# EAGLE design Stemma_Notecard (EAGLE 9.6.2)
COMPANY: ADAFRUIT INDUSTRIES; DRAWN: KTOWN; REV: A
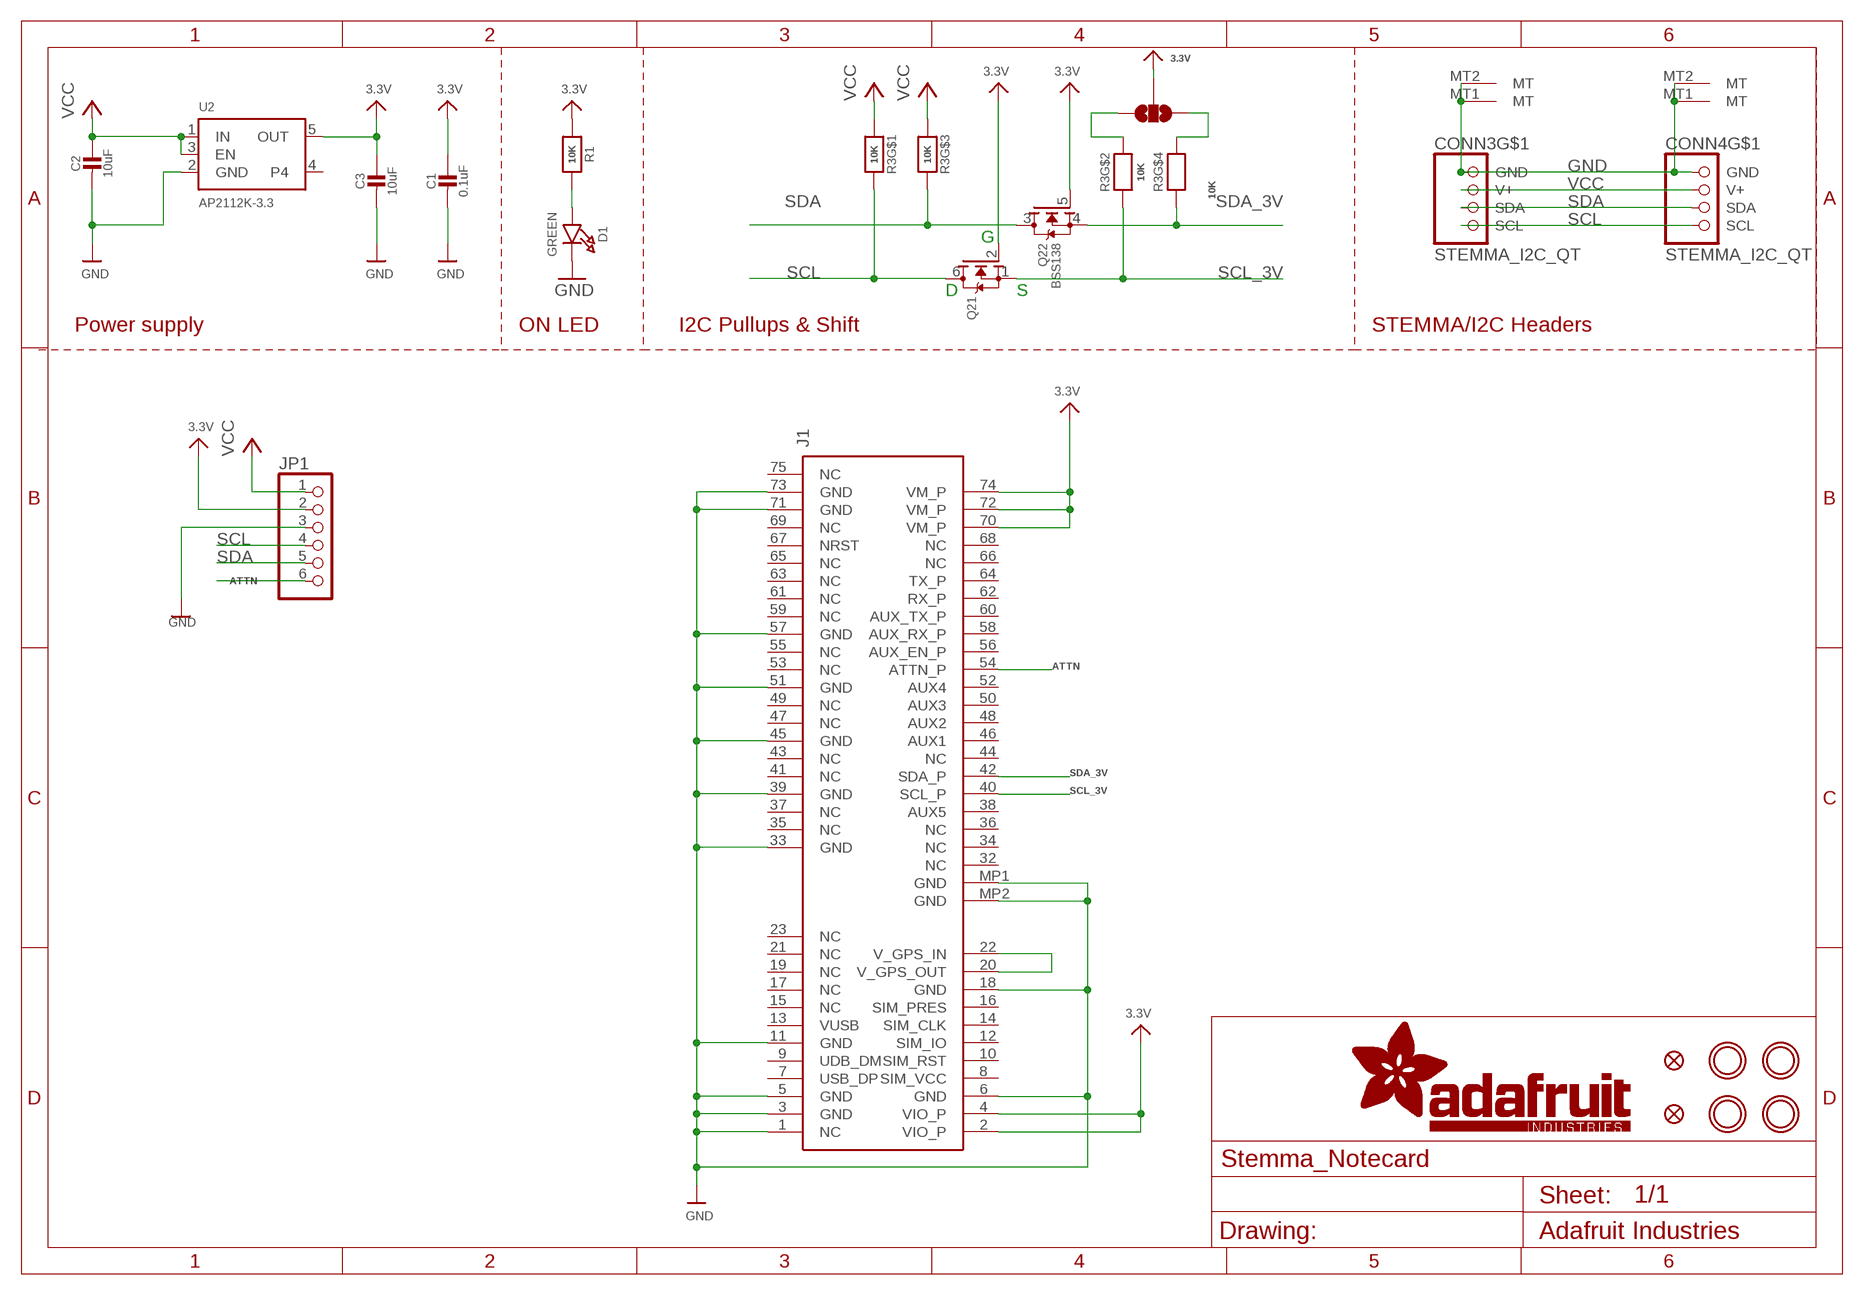
[diagram p0: schematic, sheet 1]

## Parts
C1  0.1uF  CAP_CERAMIC0603_NO  [0603-NO]
C2  10uF  CAP_CERAMIC0805-NOOUTLINE  [0805-NO]
C3  10uF  CAP_CERAMIC0805-NOOUTLINE  [0805-NO]
CONN3  STEMMA_I2C_QT  [JST_SH4]
CONN4  STEMMA_I2C_QT  [JST_SH4]
D1  GREEN  LED0603_NOOUTLINE  [CHIPLED_0603_NOOUTLINE]
FID3  FIDUCIAL_1MM  [FIDUCIAL_1MM]
FID4  FIDUCIAL_1MM  [FIDUCIAL_1MM]
J1  MDT420E01001NOTECARD  [NOTECARD]
JP1  HEADER-1X670MIL  [1X06_ROUND_70]
JP2  JUMPER-SMT_3_NO_NO-SILK  [SMT-JUMPER_3_NO_NO-SILK]
Q2  BSS138  MOSFET-N_DUAL  [SOT363]
R1  10K  RESISTOR_0603_NOOUT  [0603-NO]
R3  10K  RESISTOR_4PACK  [RESPACK_4X0603]
U2  AP2112K-3.3  VREG_SOT23-5  [SOT23-5]
U$1  MOUNTINGHOLE2.5  [MOUNTINGHOLE_2.5_PLATED]
U$17  MOUNTINGHOLE2.5  [MOUNTINGHOLE_2.5_PLATED]
U$19  MOUNTINGHOLE2.5  [MOUNTINGHOLE_2.5_PLATED]
U$21  MOUNTINGHOLE2.5  [MOUNTINGHOLE_2.5_PLATED]

## Nets
3.3V [lowpower]: C1.1 C3.1 J1.2(VIO_P) J1.4(VIO_P) J1.70(VM_P) J1.72(VM_P) J1.74(VM_P) JP1.2 JP2.2 Q2.2(1:G) Q2.5(2:G) R1.1 U2.5(OUT)
ATTN: J1.54(ATTN_P) JP1.6
GND [highpower]: C1.2 C2.2 C3.2 CONN3.1(GND) CONN3.MT1(MT) CONN3.MT2(MT) CONN4.1(GND) CONN4.MT1(MT) CONN4.MT2(MT) D1.C J1.1(NC) J1.3(GND) J1.5(GND) J1.6(GND) J1.11(GND) J1.18(GND) J1.33(GND) J1.39(GND) J1.45(GND) J1.51(GND) J1.57(GND) J1.71(GND) J1.73(GND) J1.MP1(GND) J1.MP2(GND) JP1.3 U2.2(GND)
N$1: D1.A R1.2
N$2: J1.20(V_GPS_OUT) J1.22(V_GPS_IN)
N$3: JP2.3 R3.2
N$4: JP2.1 R3.4
SCL: CONN3.4(SCL) CONN4.4(SCL) JP1.4 Q2.6(1:D) R3.8
SCL_3V: J1.40(SCL_P) Q2.1(1:S) R3.7
SDA: CONN3.3(SDA) CONN4.3(SDA) JP1.5 Q2.3(2:D) R3.6
SDA_3V: J1.42(SDA_P) Q2.4(2:S) R3.5
VCC [highpower]: C2.1 CONN3.2(V+) CONN4.2(V+) JP1.1 R3.1 R3.3 U2.1(IN) U2.3(EN)
Unconnected: J1.7(USB_DP) J1.8(SIM_VCC) J1.9(UDB_DM) J1.10(SIM_RST) J1.12(SIM_IO) J1.13(VUSB) J1.14(SIM_CLK) J1.15(NC) J1.16(SIM_PRES) J1.17(NC) J1.19(NC) J1.21(NC) J1.23(NC) J1.32(NC) J1.34(NC) J1.35(NC) J1.36(NC) J1.37(NC) J1.38(AUX5) J1.41(NC) J1.43(NC) J1.44(NC) J1.46(AUX1) J1.47(NC) J1.48(AUX2) J1.49(NC) J1.50(AUX3) J1.52(AUX4) J1.53(NC) J1.55(NC) J1.56(AUX_EN_P) J1.58(AUX_RX_P) J1.59(NC) J1.60(AUX_TX_P) J1.61(NC) J1.62(RX_P) J1.63(NC) J1.64(TX_P) J1.65(NC) J1.66(NC) J1.67(NRST) J1.68(NC) J1.69(NC) J1.75(NC) U2.4

## Notes on the sheet
- G
- D | S
- Power supply | ON LED | I2C Pullups & Shift | STEMMA/I2C Headers

## Library data of the parts
C1-C3 = microbuilder:CAP_CERAMIC: Ceramic Capacitors For new designs, use the packages preceded by an '_' character since they are more reliable: The following footprints should be used on most boards: _0402 - Standard footprint for regular board layouts _0603 - Standard footprint for regular board layouts _0805 - Standard footprint for regular board layouts _1206 - Standard footprint for regular board layouts For extremely tight-pitch boards where space is at a premium, the following 'micro-pitch' footprints can be used (smaller pads, no silkscreen outline, etc.): _0402MP - Micro-pitch footprint for very dense/compact boards _0603MP - Micro-pitch footprint for very dense/compact boards _0805MP - Micro-pitch footprint for very dense/compact boards _1206MP - Micro-pitch footprint for very dense/compact boards
CONN3 CONN4 = microbuilder:STEMMA_I2C
D1 = microbuilder:LED: LED 0603 - 0603 Surface Mount Package 2mA: Green LED - Low Power (3.9mcd, 2ma, 1.7Vf) - Digikey: 475-2709-2-ND Orange LED - Low Power (9.8mcd, 2ma, 1.8Vf) - Digikey: 475-1194-2-ND Red LED - Low Power (5mcd, 2ma, 1.8Vf) - Digikey: 475-1195-2-ND Yellow LED - Low Power (7mcd, 2ma, 1.8Vf) - Digikey: 475-1196-2-ND 5mA: Blue LED - Low Power (17mcd, 5ma, 2.9Vf) - Digikey: LNJ937W8CRACT-ND 0805 - 0805 Surface Mount Package 2mA: Red LED (8.8mcd, 2mA, 1.8Vf, Clear) - Low Power [Digikey: 475-2510-1-ND] Green LED (5mcd, 2mA, 1.8Vf, Clear) - Low Power [Digikey: 475-2730-1-ND] Yellow LED (11.3mcd, 2mA, 1.8Vf, Clear) - Low Power [Digikey: 475-2555-1-ND] 20mA: Red LED (104mcd, 20mA, Diffused) - LS R976 [Digikey: 475-1278-6-ND] Red LED (12mcd, 20mA, 2.0Vf, Clear) - APT2012EC [Digikey: 754-1128-1-ND] Green LED (15mcd, 20mA, 2.2Vf, Clear) - APT2012GC [Digikey: 754-1131-1-ND] Orange LED (160mcd, 20mA, 2.1Vf, Clear) - APT2012SECK [Digikey: 754-1130-1-ND] 1206 - 1206 Surface Mount Package Green LED (26mcd, 20mA, Diffused) - LG N971 [Digikey: 475-1407-6-ND] Red LED (15mcd, 20mA, Diffused) - LH N974 [Digikey: 475-1416-6-ND] Cree - Cree High-Power Surface Mount LEDs XPEBWT-L1-0000-00D50 - White 111lm 350mA 2.9Vf 6200K 110° XTEAWT-00-0000-00000LEE3 - White 114lm 350mA 2.85Vf 5000K 115° Everlight - Everlight 45-21 Series Surface Mount LEDs 45-21/QK2C-B2832AC2CB2/2T - Warm White 2000mcd 20mA 3.25Vf 3050K 120° 45-21/LK2C-B38452C4CB2/2T - Nuetral White 2000mcd 20mA 3.25Vf 4150K 120° 45-21/LK2C-B50634C6CB2/2T - Cold White 2200mcd 20mA 3.25Vf 5650K 120° PLCC2 Reverse Mount LS T77K-J1L2-1-0-2-R18-Z - Red 11.25mcd 2mA 1.8Vf 630nm 120° LO T77K-L1M2-24-Z - Orange 19.6mcd 2mA 1.8Vf 606nm 120° LY T77K-K2M1-26-Z - Yellow 15.7mcd 2mA 1.8Vf 587nm 120°
FID3 FID4 = microbuilder:FIDUCIAL: Fiducial Alignment Points Various fiducial points for machine vision alignment.; BOM: EXCLUDE
J1 = notecard:MDT420E01001: PCI Express / PCI Connectors 67P SMT RCPT H4.20 E Key, 30u" Au Source: Datasheet <https://componentsearchengine.com/Datasheets/1/MDT420E01001.pdf>
JP1 = microbuilder:HEADER-1X6: PIN HEADER
JP2 = SparkFun-Jumpers:JUMPER-SMT_3_NO: Normally open jumper This jumper has three pads in close proximity to each other. Apply solder to close the connection(s).
Q2 = microbuilder:MOSFET-N_DUAL: Dual N-Channel MOSFET SOT363 (2.0x1.25mm) 2N7002PS - 60V, 320mA [Digikey: 568-5984-1-ND]
R1 = microbuilder:RESISTOR: Resistors For new designs, use the packages preceded by an '_' character since they are more reliable: The following footprints should be used on most boards: _0402 - Standard footprint for regular board layouts _0603 - Standard footprint for regular board layouts _0805 - Standard footprint for regular board layouts _1206 - Standard footprint for regular board layouts For extremely tight-pitch boards where space is at a premium, the following 'micro-pitch' footprints can be used (smaller pads, no silkscreen outline, etc.): _0402MP - Micro-pitch footprint for very dense/compact boards _0603MP - Micro-pitch footprint for very dense/compact boards _0805MP - Micro-pitch footprint for very dense/compact boards _1206MP - Micro-pitch footprint for very dense/compact boards
R3 = microbuilder:RESISTOR_4PACK: Resistor Packs (4 resistors) 4 x 0603 10K 1/16W - Digikey: YC164J-10KCT-ND
U2 = microbuilder:VREG_SOT23-5: SOT23-5 Fixed Voltage Regulators Part Current Out V Out V In V Dropout θJA (°C/W) TJ (°C) Digikey Part No. ADP121 150mA 3.3V 3.4-5.5V 0.09V @ 150mA -- -- ADP121-AUJZ33R7CT-ND ADP121 150mA 3.0V 3.1-5.5V 0.09V @ 150mA -- -- ADP121-AUJZ30R7CT-ND ADP122 300mA 3.3V 3.4-5.5V 0.085V @ 300mA -- -- ADP122AUJZ-3.3-R7CT-ND ADP1712 300mA 3.3V 3.5-5.5V 0.17V @ 300mA -- -- ADP1712AUJZ-3.3-R7TR-ND AP7311 (Low Cost) 150mA 3.3V 3.5-6V 0.15V @ 150mA -- -- AP7311-33WG-7DICT-ND LD39015M18R 150mA 1.8V 1.9V-5.5V 0.08V @ 100mA -- -- 497-6977-1-ND LP2985A-33DBVR 150mA 3.3V 3.3-16V 0.28V @ 150mA 206 150 296-18479-1-ND MCP1824T-3302E/OT 300mA 3.3V 3.5V-6V 0.2V @ 300mA -- -- MCP1824T-3302E/OTCT-ND MIC5205-2.5YM5 TR 150mA 2.5V 2.7-16V 0.165V @ 150mA -- -- 576-1257-2-ND MIC5205-3.0YM5 TR 150mA 3.0V 3.2V-16V 0.165V @ 150mA -- -- 576-1258-2-ND MIC5205-3.3YM5 TR 150mA 3.3V 3.5V-16V 0.165V @ 150mA -- -- 576-1259-2-ND TPS780330220 150mA 3.3V+2.2V 3.6-5.5V 250mV Max -- -- 296-23332-1-ND TDA3663/N1,135 100mA 3.3V 3.5-45V 0.18V @ 50mA -- -- 568-5343-1-ND Max operating temp can be calculated using θJA, TJ (max junction temperature), and power in watts. Set the "Maximum Ambient Temperature" until it reaches TJ ("Max Junction Temperature"), which is the absolute limit for safe use of the regulator: Heat Sink Temperature Calculator <http://www.daycounter.com/Calculators/Heat-Sink-Temperature-Calculator.phtml> For example, With 12V source into a 3.3V LP2985 and a 30mA load, we are dissipating (12V-3.3V) * 0.03A = 0.261W. With a θJA of 206 °C/W, a TJ of 150°C, and 261mW we can safely use the chip without a heat sink up to 75°C (=147.1°C Junction Temperature).
U$1 U$17 U$19 U$21 = microbuilder:MOUNTINGHOLE: Mounting Hole For #2 screws (0.086"/2.18mm width, 0.094"/2.4mm hole) use 2.5mm; BOM: EXCLUDE

## Net classes
1 highpower: width 0.305 mm, drill 0.483 mm
2 lowpower: width 0.254 mm, drill 0.483 mm

## Board
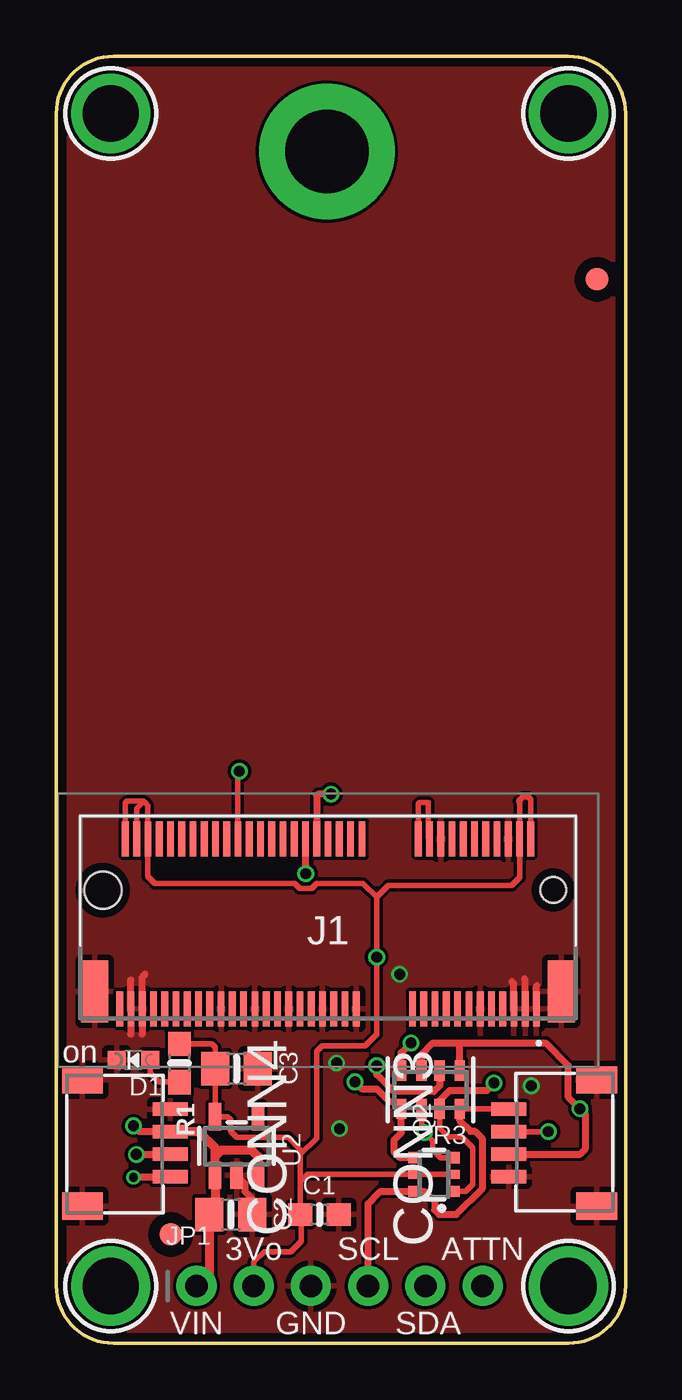
[diagram p1: board, top side]
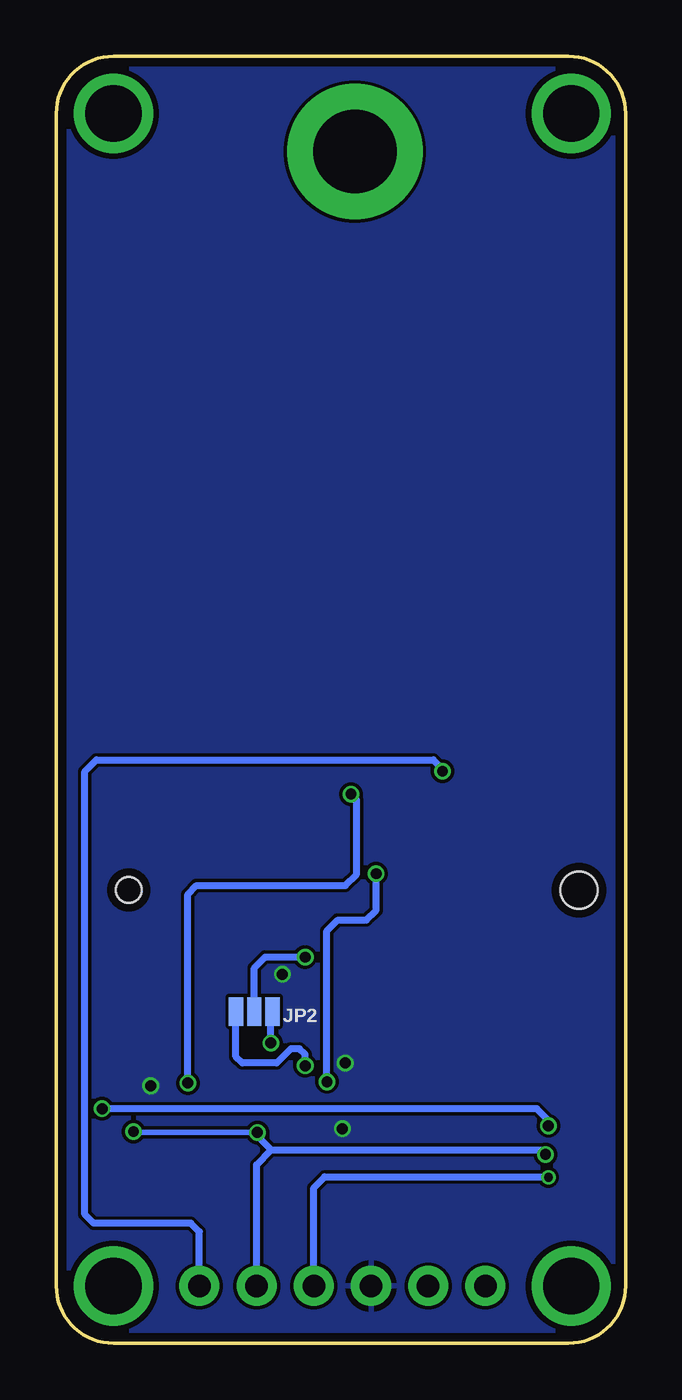
[diagram p2: board, bottom side, seen from below]

Size 25.27 x 57.15 mm. Coordinates in mm from the lower left corner, seen from the top.
Outline: 22.73,0 2.54,0 arc-90 0,2.54 0,54.61 arc-90 2.54,57.15 22.73,57.15 arc-90 25.27,54.61 25.27,2.54 arc-90 22.73,0
Copper layers (1*16): Top 0.035559375mm / dielectric 1.6mm / Bottom 0.035559375mm
Design rules "oshpark-2layer": minimum track width 6mil, minimum drill 10mil, track to track 6mil, track to pad 6mil, pad to pad 6mil, via to via 6mil, smd to smd 6mil, copper to edge 15mil, drill to drill 6mil, minimum pad ring 5mil, minimum via ring 5mil, stop-mask expansion 2.5mil, vias tented up to drill 0mil, thermal gap 10mil

### Footprints (pad centres in the part's own frame; a part is rotated, then mirrored left to right if it is on the bottom)
0603-NO = smd 1.075 x 1: 1 -0.85,0; 2 0.85,0
0805-NO = smd 1.24 x 1.5: 1 -0.95,0; 2 0.95,0
JST_SH4 = smd 0.6 x 1.55: 1 -1.5,2.514; 2 -0.5,2.514; 3 0.5,2.514; 4 1.5,2.514 | smd 1.2 x 1.8: MT1 -2.8,-1.386; MT2 2.8,-1.386
CHIPLED_0603_NOOUTLINE = smd 0.8 x 0.8: A 0,-0.75; C 0,0.75
FIDUCIAL_1MM = smd 1 x 1: 1 0,0
NOTECARD = smd 0.3 x 1.55: 1 -9.25,4.075; 2 -9,-3.475; 3 -8.75,4.075; 4 -8.5,-3.475; 5 -8.25,4.075; 6 -8,-3.475; 7 -7.75,4.075; 8 -7.5,-3.475; 9 -7.25,4.075; 10 -7,-3.475; 11 -6.75,4.075; 12 -6.5,-3.475; 13 -6.25,4.075; 14 -6,-3.475; 15 -5.75,4.075; 16 -5.5,-3.475; 17 -5.25,4.075; 18 -5,-3.475; 19 -4.75,4.075; 20 -4.5,-3.475; 21 -4.25,4.075; 22 -4,-3.475; 23 -3.75,4.075; 32 -1.5,-3.475; 33 -1.25,4.075; 34 -1,-3.475; 35 -0.75,4.075; 36 -0.5,-3.475; 37 -0.25,4.075; 38 0,-3.475; 39 0.25,4.075; 40 0.5,-3.475; 41 0.75,4.075; 42 1,-3.475; 43 1.25,4.075; 44 1.5,-3.475; 45 1.75,4.075; 46 2,-3.475; 47 2.25,4.075; 48 2.5,-3.475; 49 2.75,4.075; 50 3,-3.475; 51 3.25,4.075; 52 3.5,-3.475; 53 3.75,4.075; 54 4,-3.475; 55 4.25,4.075; 56 4.5,-3.475; 57 4.75,4.075; 58 5,-3.475; 59 5.25,4.075; 60 5.5,-3.475; 61 5.75,4.075; 62 6,-3.475; 63 6.25,4.075; 64 6.5,-3.475; 65 6.75,4.075; 66 7,-3.475; 67 7.25,4.075; 68 7.5,-3.475; 69 7.75,4.075; 70 8,-3.475; 71 8.25,4.075; 72 8.5,-3.475; 73 8.75,4.075; 74 9,-3.475; 75 9.25,4.075 | smd 1.2 x 2.75: MP1 -10.35,3.3; MP2 10.35,3.3 | drill 3.7 pad 6: P$1 0.05,-34 | hole 1.15: -10,-1.2 | hole 1.65: 10,-1.2
1X06_ROUND_70 = drill 1 pad 1.778: 1 -6.35,0; 2 -3.81,0; 3 -1.27,0; 4 1.27,0; 5 3.81,0; 6 6.35,0
SMT-JUMPER_3_NO_NO-SILK = smd 0.635 x 1.27: 1 -0.813,0; 2 0,0; 3 0.813,0
SOT363 = smd 0.5 x 0.5: 1 -0.75,-0.9; 3 0.75,-0.9; 4 0.75,0.9; 6 -0.75,0.9 | smd 0.4 x 0.5: 2 0,-0.9; 5 0,0.9
RESPACK_4X0603 = smd 0.45 x 0.9: 1 -1.3,-0.85; 2 -0.4,-0.85; 3 0.4,-0.85; 4 1.3,-0.85; 5 1.3,0.85; 6 0.4,0.85; 7 -0.4,0.85; 8 -1.3,0.85
SOT23-5 = smd 0.55 x 1.2: 1 -0.95,-1.3; 2 0,-1.3; 3 0.95,-1.3; 4 0.95,1.3; 5 -0.95,1.3
MOUNTINGHOLE_2.5_PLATED = drill 2.5 pad 3.2: P$1 0,0

### Placement (x,y rotation side)
C1  11.68,5.71 0 top
C2  7.75,5.71 0 top
C3  8,12.19 0 top
CONN3  22.61,8.89 90 top
CONN4  2.54,8.89 270 top
D1  3.43,12.57 90 top
FID3  5.08,4.83 0 top
FID4  24,47.24 0 top
J1  12.06,18.92 180 top
JP1  12.57,2.54 0 top
JP2  16.48,14.73 180 bottom
Q2  16.76,7.49 90 top
R1  5.46,12.45 270 top
R3  16.61,11.25 180 top
U2  8,8.76 0 top
U$1  2.41,54.61 0 top
U$17  22.73,54.61 0 top
U$19  2.41,2.54 0 top
U$21  22.73,2.54 0 top

### Tracks (layer width: path | path; a pad name or v marks a point on that pad's centre or on a via)
3.3V  (via drill 0.48)
  Top 0.254: R1.1 6.9,13.3 7.05,13.14 C3.1 U2.5 7.62,10.06 7.75,9.93 7.75,9.4 8,9.14 10.29,9.14 10.83,8.6 10.83,8.38 | Q2.2 Q2.5 11.15,7.49 10.83,7.18 | 10.83,7.18 C1.1 10.87,5.68 10.87,4.52 10.41,4.06 9.22,4.06 8.76,3.61 JP1.2 | 10.83,7.18 10.83,8.38 | 10.83,8.38 11.56,9.11 11.56,12.95 11.81,13.21 13.72,13.21 14.22,13.72 v14.22,17.14 14.22,19.81 | 14.22,19.81 14.73,20.32 20.22,20.32 20.57,20.68 20.57,22.39 J1.4 20.57,24.04 20.52,24.08 20.7,24.26 20.96,24.26 21.07,24.15 J1.2 | 14.22,19.81 13.61,20.42 11.56,20.42 11.34,20.21 10.81,20.21 10.59,20.42 4.37,20.42 4.06,20.73 J1.70 4.06,23.88 3.94,24 | J1.72 3.57,23.76 3.81,24 3.94,24 | J1.74 3.07,24 3.15,24.08 3.86,24.08 3.94,24
  Bottom 0.305: v14.22,17.14 16,17.14 16.48,16.66 JP2.2
ATTN  (via drill 0.48)
  Top 0.254: J1.54 8.06,25.34 v8.13,25.4
  Bottom 0.305: JP1.6 18.92,4.95 19.3,5.33 23.62,5.33 24,5.71 24,25.4 23.5,25.91 8.53,25.91 8.08,25.45 v8.13,25.4
GND  (via drill 0.48)
  Top 0.305: U2.2 8.37,7.09 8.37,6.74 8.7,6.41 C2.2 | 3.3,16.13 3.32,16.12 J1.73 3.32,13.73 3.3,13.72 | 3.94,16.38 3.82,16.26 J1.71 3.81,13.72 | J1.1 21.32,15.85 21.34,15.88 | J1.3 20.82,16.14 20.78,16.18 | J1.5 20.32,15.96 20.22,16.05
  other vias: 12.45,12.45 12.57,9.53 21.08,11.43 15.24,16.38
  pour Top: -8,77.47 41.78,77.47 41.78,-4.45 -8,-4.45
  pour Bottom: -8,77.6 41.91,77.6 41.91,-4.57 -8,-4.57
N$1
  Top 0.254: R1.2 4.56,11.6 4.17,11.99 4.17,12.56 D1.A
N$2
  Top 0.254: J1.22 16.07,23.94 16.13,24 16.51,24 16.51,22.45 J1.20
N$3  (via drill 0.48)
  Top 0.305: R3.2 17.01,11.42 16.76,11.18 14.99,11.18 14.22,11.94 v14.22,12.32
  Bottom 0.305: v14.22,12.32 14.22,12.83 14.48,13.08 14.86,13.08 15.49,12.45 17.02,12.45 17.3,12.72 JP2.3
N$4  (via drill 0.48)
  Top 0.305: 15.31,12.76 R3.4 15.31,12.9 v15.75,13.34
  Bottom 0.305: v15.75,13.34 15.75,14.66 JP2.1
SCL  (via drill 0.38)
  Top 0.254: R3.8 20.08,10.4 CONN3.4
  Top 0.305: JP1.4 13.84,6.2 14.39,6.74 Q2.6 16.35,6.74 16.79,6.3 16.79,5.92 16.99,5.71 17.76,5.71 18.92,6.88 18.92,9.07 18.59,9.4 18.39,9.4 17.91,9.88 R3.8 | v3.43,7.37 3.45,7.39 CONN4.4
  Bottom 0.305: JP1.4 13.84,6.91 13.36,7.39 3.45,7.39 v3.43,7.37
SCL_3V  (via drill 0.48)
  Top 0.254: R3.7 17.01,9.53 17.37,9.17 18.01,9.17 18.49,8.69 18.49,7.06 18.17,6.74 Q2.1
  Top 0.305: v19.43,11.56 19.43,11.53 19.13,11.23 17.46,11.23 17.01,10.78 R3.7 | v12.19,24.38 11.63,24.38 11.56,24.31 J1.40
  Bottom 0.305: v19.43,11.56 19.43,19.94 19.05,20.32 12.45,20.32 11.94,20.83 11.94,24.13 v12.19,24.38
SDA  (via drill 0.48)
  Top 0.254: Q2.3 17.05,8.24 16.71,8.59 16.71,8.99 v16.35,9.36 16.21,9.49 R3.6 | v21.84,9.4 v21.84,9.39 CONN3.3
  Top 0.305: v3.56,8.38 3.56,8.39 CONN4.3
  Bottom 0.254: v16.35,9.36 21.81,9.36 v21.84,9.4
  Bottom 0.305: JP1.5 16.38,7.92 15.72,8.59 | 15.72,8.59 3.76,8.59 v3.56,8.38 | v16.35,9.36 16.35,9.21 15.72,8.59
SDA_3V  (via drill 0.48)
  Top 0.305: Q2.4 15.25,8.24 14.99,8.51 14.99,9.02 15.32,9.35 R3.5 14.99,10.72 14.8,10.72 14.24,11.28 13.59,11.28 v13.26,11.61 | v11.07,20.85 11.06,20.86 J1.42
  Bottom 0.305: v13.26,11.61 13.26,18.31 12.78,18.8 11.51,18.8 11.07,19.23 v11.07,20.85
VCC  (via drill 0.48)
  Top 0.305: CONN3.2 23.25,8.39 23.5,8.64 23.5,10.16 v23.24,10.41 22.73,10.92 22.73,12.32 21.72,13.34 17.91,13.34 | R3.1 17.91,13.33 17.91,13.34 | CONN4.2 3.69,9.39 v3.43,9.65 | R3.3 16.21,12.83 16.71,13.34 17.91,13.34
  Top 0.406: U2.1 7.05,8.3 7.34,8.59 8.66,8.59 8.97,8.28 8.97,7.48 U2.3 | U2.1 7.05,8.67 6.33,9.39 CONN4.2 | U2.1 7.05,5.91 6.48,5.33 6.48,5.39 C2.1 6.8,3.11 JP1.1
  Bottom 0.305: v3.43,9.65 3.43,9.91 3.94,10.41 v23.24,10.41

### Text on the board
tPlace: on | 3Vo | SCL | ATTN | VIN | GND | SDA